# Altium schematic sheet PMIC_reference.SchDoc
size A4; Organization: Vatapi
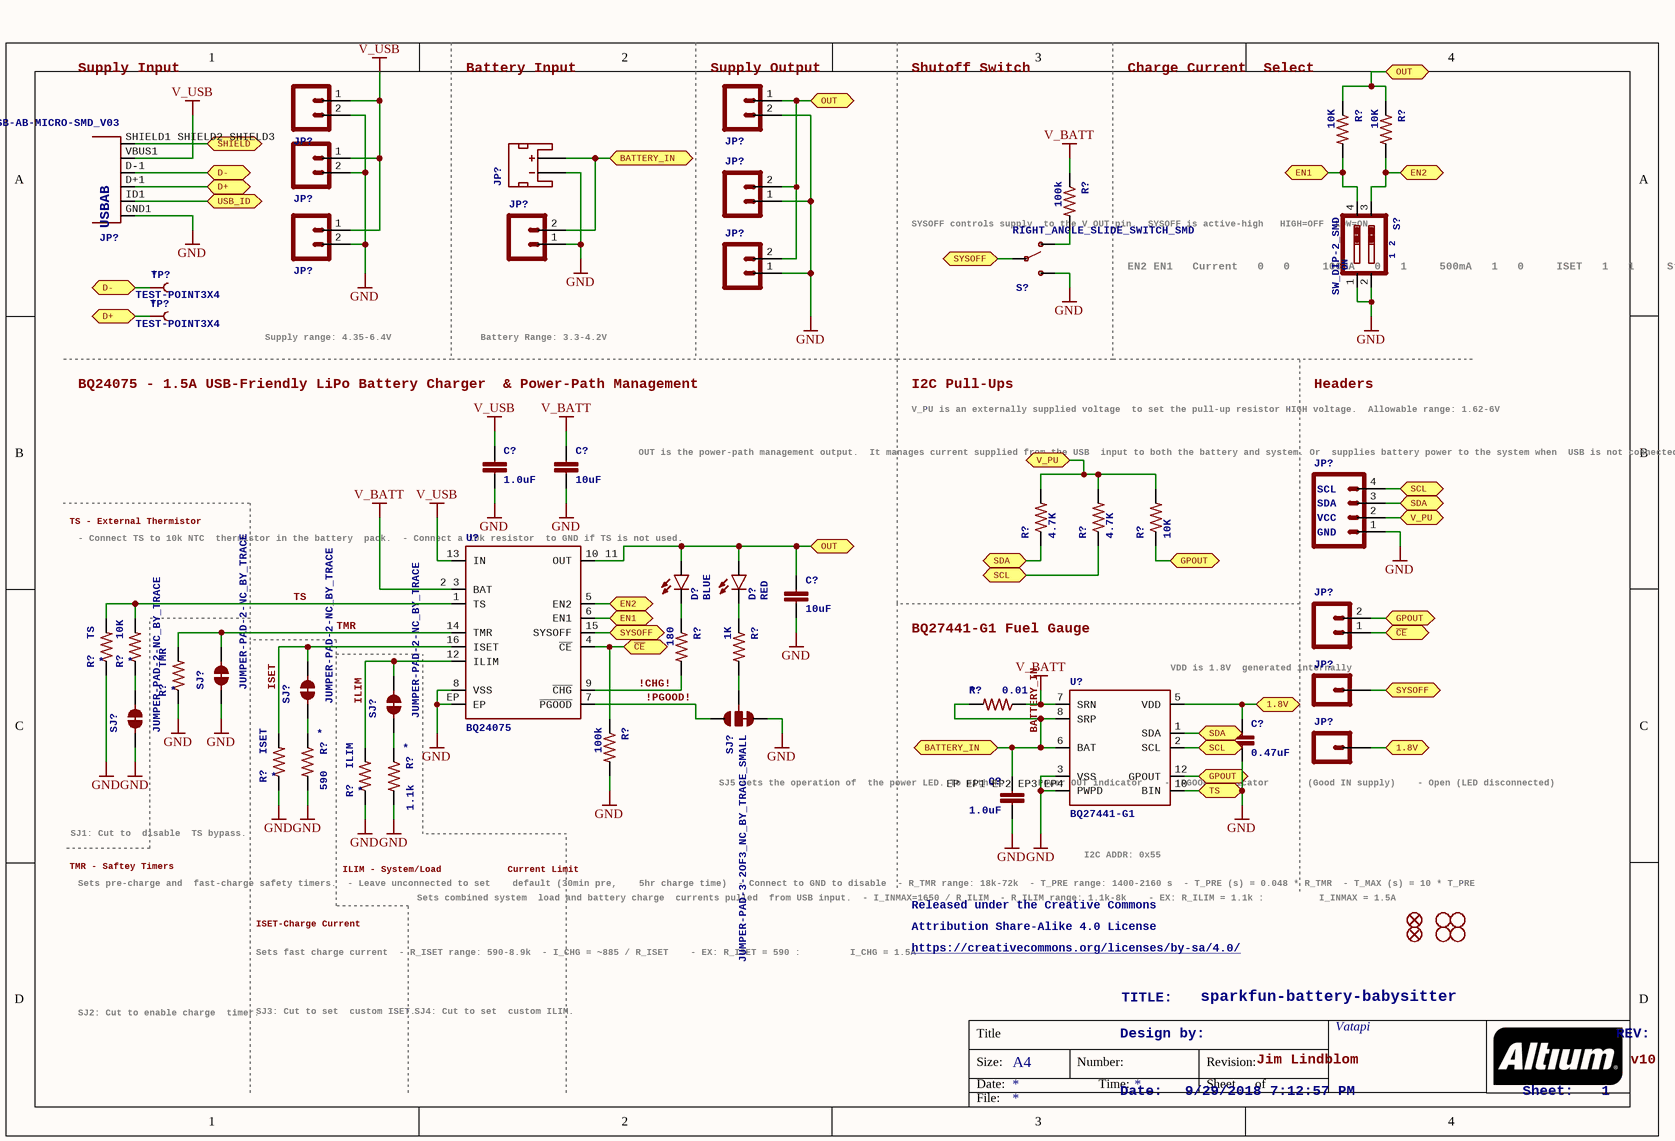
[diagram p0: PMIC_reference.SchDoc]

## Parts
(Parts that share a designator on the sheet are numbered #1, #2 ... from top to bottom, then left to right.)
C?#1  1.0uF  [1206-CAP]
C?#2  10uF  [0805-CAP]
C?#3  10uF  [0805-CAP]
C?#4  0.47uF  [0603-CAP]
C?#5  1.0uF  [0603-CAP]
D?#1  BLUE  [LED-0603]
D?#2  RED  [LED-0603]
FID?#1  FIDUCIAL1X2  [FIDUCIAL-1X2]  (value not drawn)
FID?#2  FIDUCIAL1X2  [FIDUCIAL-1X2]  (value not drawn)
JP?#1  M021X02_NO_SILK  [1X02_NO_SILK]  (value not drawn)
JP?#2  M023.5MM-NO_SILK  [SCREWTERMINAL-3.5MM-2-NS]  (value not drawn)
JP?#3  M023.5MM-NO_SILK  [SCREWTERMINAL-3.5MM-2-NS]  (value not drawn)
JP?#4  JST_2MM_MALE  [JST-2-SMD]  (value not drawn)
JP?#5  USB-AB-MICRO-SMD_V03  [USB-AB-MICRO-SMD_V03]
JP?#6  M021X02_NO_SILK  [1X02_NO_SILK]  (value not drawn)
JP?#7  M021X02_NO_SILK  [1X02_NO_SILK]  (value not drawn)
JP?#8  M021X02_NO_SILK  [1X02_NO_SILK]  (value not drawn)
JP?#9  M02-JST-2-PTH-NO_SILK  [JST-2-PTH-NS]  (value not drawn)
JP?#10  I2C_STANDARD_NO_SILK  [1X04_NO_SILK]  (value not drawn)
JP?#11  M021X02_NO_SILK  [1X02_NO_SILK]  (value not drawn)
JP?#12  M01PTH_NO_SILK_YES_STOP  [1X01_NO_SILK]  (value not drawn)
JP?#13  M01PTH_NO_SILK_YES_STOP  [1X01_NO_SILK]  (value not drawn)
R?#1  10K  [0603-RES]
R?#2  10K  [0603-RES]
R?#3  100k  [0603-RES]
R?#4  4.7K  [0603-RES]
R?#5  4.7K  [0603-RES]
R?#6  10K  [0603-RES]
R?#7  TS  [1/6W-RES]
R?#8  10K  [0603-RES]
R?#9  180  [0603-RES]
R?#10  1K  [0603-RES]
R?#11  TMR  [1/6W-RES]
R?#12  0.01  [1206]
R?#13  100k  [0603-RES]
R?#14  ISET  [1/6W-RES]
R?#15  590  [0603-RES]
R?#16  ILIM  [1/6W-RES]
R?#17  1.1k  [0603-RES]
S?#1  SW_DIP-2_SMD  [DIPSWITCH-02-50MIL]
S?#2  RIGHT_ANGLE_SLIDE_SWITCH_SMD  [SWITCH-SPST-SMD-A]
SJ?#1  JUMPER-PAD-2-NC_BY_TRACE  [PAD-JUMPER-2-NC_BY_TRACE_YES_SILK]
SJ?#2  JUMPER-PAD-2-NC_BY_TRACE  [PAD-JUMPER-2-NC_BY_TRACE_YES_SILK]
SJ?#3  JUMPER-PAD-2-NC_BY_TRACE  [PAD-JUMPER-2-NC_BY_TRACE_YES_SILK]
SJ?#4  JUMPER-PAD-2-NC_BY_TRACE  [PAD-JUMPER-2-NC_BY_TRACE_YES_SILK]
SJ?#5  JUMPER-PAD-3-2OF3_NC_BY_TRACE_SMALL  [PAD-JUMPER-3-2OF3_NC_BY_TRACE_YES_SILK_FULL_BOX]
STANDOFF?#1  STAND-OFF  [STAND-OFF]  (value not drawn)
STANDOFF?#2  STAND-OFF  [STAND-OFF]  (value not drawn)
STANDOFF?#3  STAND-OFF  [STAND-OFF]  (value not drawn)
STANDOFF?#4  STAND-OFF  [STAND-OFF]  (value not drawn)
TP?#1  TEST-POINT3X4  [PAD.03X.04]
TP?#2  TEST-POINT3X4  [PAD.03X.04]
U?#1  BQ24075  [PVQFN-N16]
U?#2  BQ27441-G1  [PDSO-N12]

## Ports
1.8V, BATTERY_IN, D+, D-, EN1, EN2, GPOUT, OUT, SCL, SDA, SHIELD, SYSOFF, TS, USB_ID, V_PU, ~{CE}

## Nets
GND: C?#1.2 C?#2.2 C?#3.2 C?#4.2 C?#5.2 JP?#1.2 JP?#2.2 JP?#3.2 JP?#4.1(-) JP?#5.GND1(GND) JP?#6.1 JP?#7.2 JP?#8.1 JP?#9.1 JP?#10.1 R?#7.1 R?#11.1 R?#13.2 R?#14.1 R?#15.2 R?#16.1 R?#17.2 S?#1.1 S?#1.2 S?#2.3(S) SJ?#1.1 SJ?#4.1 SJ?#5.3 U?#1.8(VSS) U?#1.EP U?#2.3(VSS) U?#2.10(BIN) U?#2.EP_EP1_EP2_EP3_EP4(PWPD) ; port TS
V_BATT: C?#2.1 R?#3.1 R?#12.1 U?#1.2_3(BAT) U?#2.7(SRN)
V_USB: C?#1.1 JP?#1.1 JP?#3.1 JP?#5.VBUS1(VBUS) JP?#7.1 U?#1.13(IN)
1.8V: C?#4.1 JP?#13.1 U?#2.5(VDD) ; port 1.8V
!CHG!: R?#9.2 U?#1.9(~{CHG})
!PGOOD!: SJ?#5.1 U?#1.7(~{PGOOD})
BATTERY_IN: C?#5.1 JP?#4.2(+) JP?#8.2 R?#12.2 U?#2.6(BAT) U?#2.8(SRP) ; port BATTERY_IN
~{CE}: JP?#11.1 R?#13.1 U?#1.4(~{CE}) ; port ~{CE}
D+: JP?#5.D+1(D+) TP?#2.P$1 ; port D+
D-: JP?#5.D-1(D-) TP?#1.P$1 ; port D-
EN1: R?#1.2 S?#1.4 U?#1.6(EN1) ; port EN1
EN2: R?#2.2 S?#1.3 U?#1.5(EN2) ; port EN2
GPOUT: JP?#11.2 R?#6.1 U?#2.12(GPOUT) ; port GPOUT
ILIM: R?#16.2 SJ?#3.2 U?#1.12(ILIM)
ISET: R?#14.2 SJ?#2.2 U?#1.16(ISET)
OUT: C?#3.1 D?#1.A D?#2.A JP?#2.1 JP?#6.2 JP?#9.2 R?#1.1 R?#2.1 U?#1.10_11(OUT) ; port OUT
SCL: JP?#10.4 R?#5.1 U?#2.2(SCL) ; port SCL
SDA: JP?#10.3 R?#4.1 U?#2.1(SDA) ; port SDA
SHIELD: JP?#5.SHIELD1_SHIELD2_SHIELD3(SHIELD) ; port SHIELD
SYSOFF: JP?#12.1 S?#2.2(P) U?#1.15(SYSOFF) ; port SYSOFF
TMR: R?#11.2 SJ?#1.2 U?#1.14(TMR)
TS: R?#7.2 R?#8.2 U?#1.1(TS)
USB_ID: JP?#5.ID1(USBID) ; port USB_ID
V_PU: JP?#10.2 R?#4.2 R?#5.2 R?#6.2 ; port V_PU
NetD?#1_C: D?#1.C R?#9.1
NetD?#2_C: D?#2.C R?#10.1
NetR?#3_2: R?#3.2 S?#2.1(O)
NetR?#8_1: R?#8.1 SJ?#4.2
NetR?#10_2: R?#10.2 SJ?#5.2
NetR?#15_1: R?#15.1 SJ?#2.1
NetR?#17_1: R?#17.1 SJ?#3.1

Not connected (* = marked no-connect by the designer): JP?#4 NC1(PAD1) NC2(PAD2)

## Notes on the sheet
- Supply Input
- Battery Input
- (near JP?#2) Supply Output
- Shutoff Switch
- Charge Current
  Select
- (near R?#3) SYSOFF controls supply
  to the V_OUT pin.
  SYSOFF is active-high
  HIGH=OFF
  LOW=ON
- (near S?#1) EN2 EN1   Current
  0   0     100mA
  0   1     500mA
  1   0     ISET
  1   1     Standby
- BQ24075 - 1.5A USB-Friendly LiPo Battery Charger
  & Power-Path Management
- Supply range: 4.35-6.4V
- Battery Range: 3.3-4.2V
- I2C Pull-Ups
- Headers
- OUT is the power-path management output.
  It manages current supplied from the USB
  input to both the battery and system. Or
  supplies battery power to the system when
  USB is not connected.
  OUT supply w/ USB: V_USB - 0.3V
  OUT supply w/o USB: V_BAT - 0.05V
- V_PU is an externally supplied voltage
  to set the pull-up resistor HIGH voltage.
  Allowable range: 1.62-6V
- TS - External Thermistor
- (near U?#1) - Connect TS to 10k NTC
  thermistor in the battery
  pack.
  - Connect a 10k resistor
  to GND if TS is not used.
- BQ27441-G1 Fuel Gauge
- VDD is 1.8V
  generated internally
- SJ5 sets the operation of
  the power LED. To either:
  - Power OUT indicator
  - !PGOOD! indicator
  (Good IN supply)
  - Open (LED disconnected)
- TMR - Saftey Timers
- SJ1: Cut to
  disable
  TS bypass.
- Sets pre-charge and
  fast-charge safety timers.
  - Leave unconnected to set
  default (30min pre,
  5hr charge time)
  - Connect to GND to disable
  - R_TMR range: 18k-72k
  - T_PRE range: 1400-2160 s
  - T_PRE (s) = 0.048 * R_TMR
  - T_MAX (s) = 10 * T_PRE
- ILIM - System/Load
  Current Limit
- I2C ADDR: 0x55
- Sets fast charge current
  - R_ISET range: 590-8.9k
  - I_CHG = ~885 / R_ISET
  - EX: R_ISET = 590 :
  I_CHG = 1.5A
- ISET-Charge Current
- Sets combined system
  load and battery charge
  currents pulled
  from USB input.
  - I_INMAX=1650 / R_ILIM
  - R_ILIM range: 1.1k-8k
  - EX: R_ILIM = 1.1k :
  I_INMAX = 1.5A
- Released under the Creative Commons
- Attribution Share-Alike 4.0 License
- SJ2: Cut to enable charge
  timer.
- SJ3: Cut to set
  custom ISET.
- SJ4: Cut to set
  custom ILIM.
- https://creativecommons.org/licenses/by-sa/4.0/
- TITLE:
- sparkfun-battery-babysitter
- Design by:
- Jim Lindblom
- REV:
- v10
- Date:
- 9/29/2018 7:12:57 PM
- Sheet:
- 1
- Title
- Size:
- A4
- Number:
- Time:
- Revision:
- Sheet
- of
- File:

## Library data of the parts
C?#1 = 1.0UF50V10%(1206): CAP-09822; PROD_ID: CAP-09822
C?#2 C?#3 = 10UF10V10%(0805): CAP-11330; PROD_ID: CAP-11330
C?#4 = CAP0603-CAP: CapacitorStandard 0603 ceramic capacitor, and 0.1" leaded capacitor.; PROD_ID: *
C?#5 = 1.0UF-16V-10%(0603): CAP-00868; PROD_ID: CAP-00868
D?#1 = LED-BLUE0603: Blue LEDs for production use    Various blue LEDs stocked by SparkFun production 0603 - DIO-08575 Rebel - DIO-09553 1206 - DIO-09911; PROD_ID: DIO-08575
D?#2 = LED-RED0603: Assorted Red LEDs LilyPad 1206- DIO-09912 1206- DIO-00809 0603- DIO-00819 "SMART" means more efficient and expensive; PROD_ID: DIO-00819
FID?#1 FID?#2 = FIDUCIAL1X2: Fiducial Alignment PointsVarious fiducial points for machine vision alignment.
JP?#1 JP?#6-JP?#8 JP?#11 = M021X02_NO_SILK: Standard 2-pin 0.1" header. Use with  - straight break away headers ( PRT-00116) - right angle break away headers (PRT-00553) - swiss pins (PRT-00743) - machine pins (PRT-00117) - female headers (PRT-00115)   Molex polarized connector foot print use with: PRT-08233 with associated crimp pins and housings.  2.54_SCREWTERM for use with  PRT-10571.  3.5mm Screw Terminal footprints for  PRT-08084  5mm Screw Terminal footprints for use with PRT-08432
JP?#2 JP?#3 = M023.5MM-NO_SILK: Standard 2-pin 0.1" header. Use with  - straight break away headers ( PRT-00116) - right angle break away headers (PRT-00553) - swiss pins (PRT-00743) - machine pins (PRT-00117) - female headers (PRT-00115)   Molex polarized connector foot print use with: PRT-08233 with associated crimp pins and housings.  2.54_SCREWTERM for use with  PRT-10571.  3.5mm Screw Terminal footprints for  PRT-08084  5mm Screw Terminal footprints for use with PRT-08432; PROD_ID: CONN-08399
JP?#4 = JST_2MM_MALE: Mates to single-cell LiPo batteries. CONN-11443 Now with smashable polarity marks!; BTM_POS: +; BTM_NEG: -; PROD_ID: CONN-11443; TOP_NEG: -; TOP_POS: +
JP?#5 = USB-ABCONN-11794: This is a USB AB connector that is compatible with USB OTG. i.e. this connector can serve as a host or device; PROD_ID: CONN-11794; USBAB: USBAB
JP?#9 = M02-JST-2-PTH-NO_SILK: Standard 2-pin 0.1" header. Use with  - straight break away headers ( PRT-00116) - right angle break away headers (PRT-00553) - swiss pins (PRT-00743) - machine pins (PRT-00117) - female headers (PRT-00115)   Molex polarized connector foot print use with: PRT-08233 with associated crimp pins and housings.  2.54_SCREWTERM for use with  PRT-10571.  3.5mm Screw Terminal footprints for  PRT-08084  5mm Screw Terminal footprints for use with PRT-08432
JP?#10 = I2C_STANDARD_NO_SILK: SparkFun has standardized on a pinout for all I2C based sensor breakouts.  This pinout allows I2C boards to be plugged directly into the headers on Arduino Uno compatible boards, and to be daisy chained easily.; SDA: SDA; VCC: VCC; GND: GND; SCL: SCL
JP?#12 JP?#13 = M01PTH_NO_SILK_YES_STOP: Header 1Standard 1-pin 0.1" header. Use with straight break away headers (SKU : PRT-00116), right angle break away headers (PRT-00553), swiss pins (PRT-00743), machine pins (PRT-00117), and female headers (PRT-00115). SMTSO-256-ET is a "flush mount" nut for a 4-40 screw. The older package used to be too tight, and did not allow it to sit properly thru the drill hit. The latest (0.165DIA) fits nice and snug.
R?#1 R?#2 R?#6 R?#8 = 10KOHM-1/10W-1%(0603)0603: RES-00824; PROD_ID: RES-00824
  R?#8: NAME: *
R?#3 R?#13 = 100KOHM-1/10W-1%(0603): RES-07828; PROD_ID: RES-07828
R?#4 R?#5 = 4.7KOHM-1/10W-1%(0603): RES-07857; PROD_ID: RES-07857
R?#7 R?#11 R?#14 R?#16 = RESISTORPTH-1/6W: ResistorBasic schematic elements and footprints for 0603, 1206, and PTH resistors.; NAME: *
R?#9 = 180OHM1/10W1%(0603): RES-08788; PROD_ID: RES-08788
R?#10 = 1KOHM-1/10W-1%(0603): RES-07856; PROD_ID: RES-07856
R?#12 = RESISTOR1206: ResistorBasic schematic elements and footprints for 0603, 1206, and PTH resistors.; NAME: *; PROD_ID: *
R?#15 R?#17 = RESISTOR0603-RES: ResistorBasic schematic elements and footprints for 0603, 1206, and PTH resistors.; NAME: *; PROD_ID: *
S?#1 = SW_DIP-2-SMT-HALFSIZE: DIP SWITCH; PROD_ID: *; 1: 1; 2: 2; ON: ON
S?#2 = SWITCH-SPDT-SMD-A: SPDT Switch Simple slide switch, Spark Fun Electronics SKU : COM-00102 DPDT SMT slide switch, AYZ0202, SWCH-08179; PROD_ID: SWCH-10651
STANDOFF?#1-STANDOFF?#4 = STAND-OFF: #4 Stand Off   This is the mechanical footprint for a #4 phillips button head screw. Use the keepout ring to avoid running the screw head into surrounding components. SKU : PRT-00447
TP?#1 TP?#2 = TEST-POINT3X4: Bare copper test points for troubleshooting or ICT; NAME: *
U?#1 = BQ24075: Texas Instruments BQ24075 LiPo Battery Chargerand Power-Path Management IC    The bq2407x series of devices are integrated Li-Ion linear chargers and system power path management devices targeted at space-limited portable applications. The devices operate from either a USB port or an AC adapter and support charge currents up to 1.5 A. The input voltage range with input overvoltage protection supports unregulated adapters. The USB input current limit accuracy and start up sequence allow the bq2407x to meet USB-IF inrush current specifications. Additionally, the input dynamic power management (VIN-DPM) prevents the charger from crashing incorrectly configured USB sources.   Datasheet SparkFun Products  SparkFun Battery Babysitter (PRT-13777); PROD_ID: *
U?#2 = BQ27441-G1: Texas Instruments BQ27441-G1 LiPo Battery Fuel Gauge    The Texas Instruments bq27441-G1 fuel gauge is a microcontroller peripheral that provides system-side fuel gauging for single-cell Li-Ion batteries. The device requires minimal user configuration and system microcontroller firmware development.   The bq27441-G1 battery fuel gauge uses the patented Impedance Trackâ„¢ algorithm for fuel gauging, and provides information such as remaining battery capacity (mAh), state-of-charge (%), and battery voltage (mV).   Datasheet SparkFun Products  SparkFun Battery Babysitter (PRT-13777); PROD_ID: *